# Altium schematic sheet led-monitoring-0402-SN74HC365PW.SchDoc: SN74HC365PW LED Monitoring
size A4; DrawnBy: Dylan Vogel; Organization: UTAT SS; Revision: 1.1
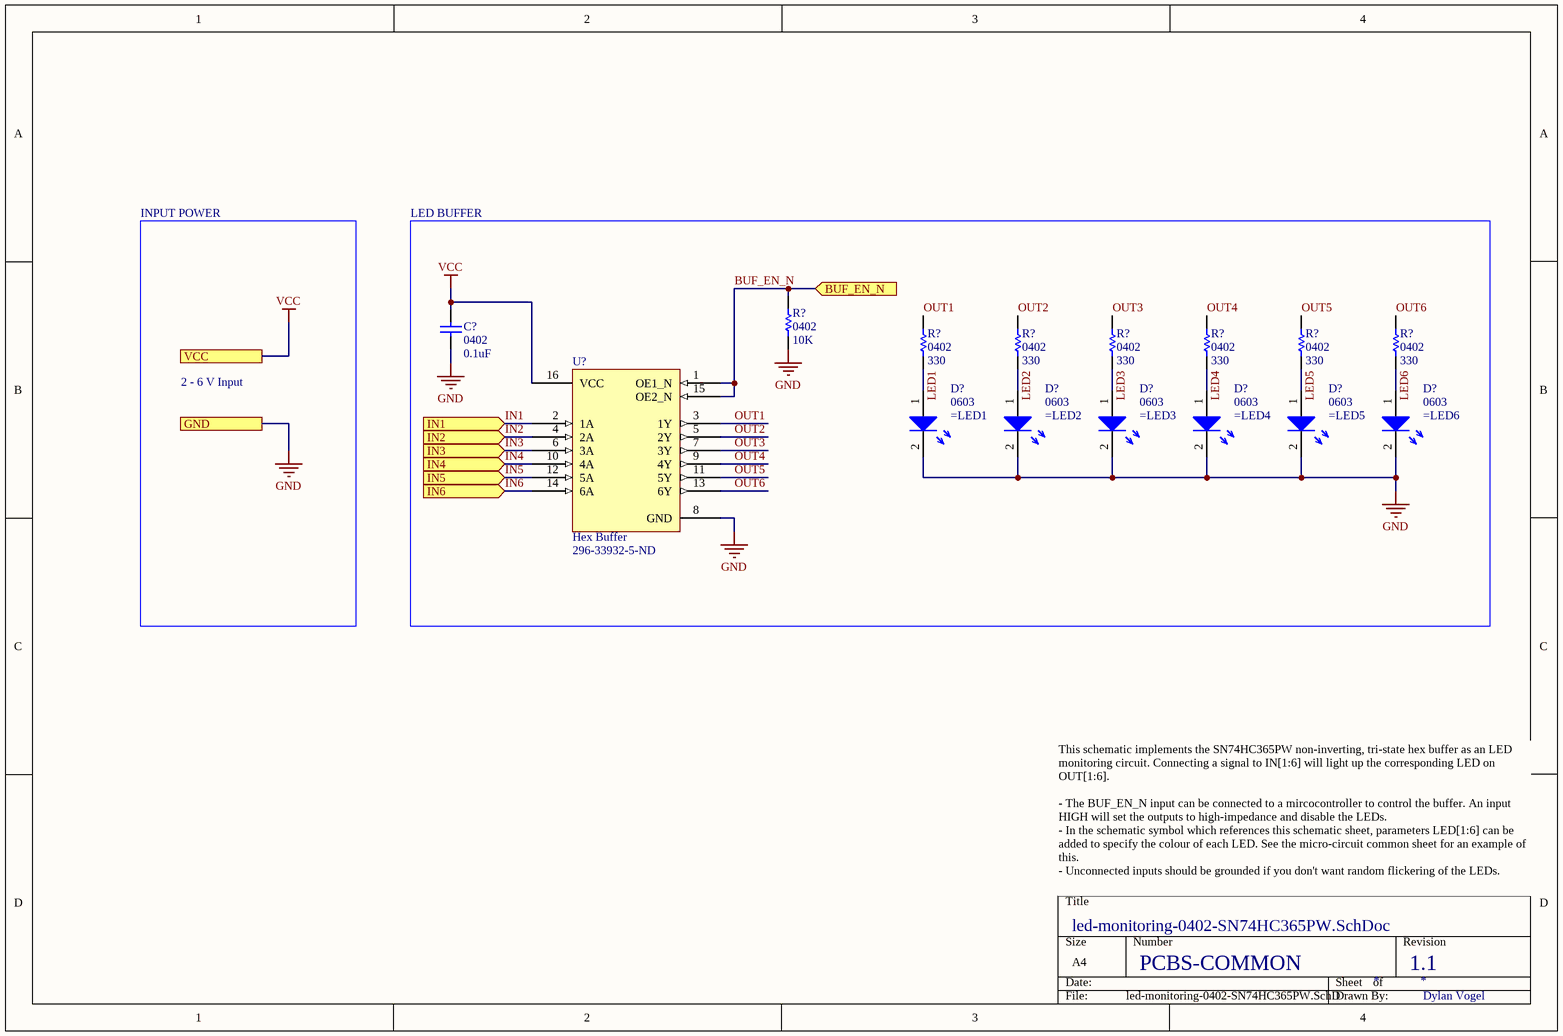
[diagram p0: led-monitoring-0402-SN74HC365PW.SchDoc]

## Parts
(Parts that share a designator on the sheet are numbered #1, #2 ... from top to bottom, then left to right.)
C?  0402  value 0.1uF  [CAP0402R]
D?#1  0603  [LED0603]
D?#2  0603  [LED0603]
D?#3  0603  [LED0603]
D?#4  0603  [LED0603]
D?#5  0603  [LED0603]
D?#6  0603  [LED0603]
R?#1  0402  value 10K  [RES0402R]
R?#2  0402  value 330  [RES0402R]
R?#3  0402  value 330  [RES0402R]
R?#4  0402  value 330  [RES0402R]
R?#5  0402  value 330  [RES0402R]
R?#6  0402  value 330  [RES0402R]
R?#7  0402  value 330  [RES0402R]
U?  Hex Buffer  Supplier Part Number 1: 296-33932-5-ND  [SOP65P640X120-16N]

## Blocks framed on the sheet
LED BUFFER: C? D?#1-D?#6 R?#1-R?#7 U?

## Ports
BUF_EN_N (in), GND, IN1 (in), IN2 (in), IN3 (in), IN4 (in), IN5 (in), IN6 (in), VCC

## Nets
GND: C?.1 D?#1.2 D?#2.2 D?#3.2 D?#4.2 D?#5.2 D?#6.2 R?#1.1 U?.8(GND) ; port GND
VCC: C?.2 U?.16(VCC) ; port VCC
BUF_EN_N: R?#1.2 U?.1(OE1_N) U?.15(OE2_N) ; port BUF_EN_N
IN1: U?.2(1A) ; port IN1
IN2: U?.4(2A) ; port IN2
IN3: U?.6(3A) ; port IN3
IN4: U?.10(4A) ; port IN4
IN5: U?.12(5A) ; port IN5
IN6: U?.14(6A) ; port IN6
LED1: D?#1.1 R?#2.1
LED2: D?#2.1 R?#3.1
LED3: D?#3.1 R?#4.1
LED4: D?#4.1 R?#5.1
LED5: D?#5.1 R?#6.1
LED6: D?#6.1 R?#7.1
OUT1: R?#2.2 U?.3(1Y)
OUT2: R?#3.2 U?.5(2Y)
OUT3: R?#4.2 U?.7(3Y)
OUT4: R?#5.2 U?.9(4Y)
OUT5: R?#6.2 U?.11(5Y)
OUT6: R?#7.2 U?.13(6Y)

## Notes on the sheet
- INPUT POWER
- 2 - 6 V Input
- This schematic implements the SN74HC365PW non-inverting, tri-state hex buffer as an LED monitoring circuit. Connecting a signal to IN[1:6] will light up the corresponding LED on OUT[1:6].
  - The BUF_EN_N input can be connected to a mircocontroller to control the buffer. An input HIGH will set the outputs to high-impedance and disable the LEDs.
  - In the schematic symbol which references this schematic sheet, parameters LED[1:6] can be added to specify the colour of each LED. See the micro-circuit common sheet for an example of this.
  - Unconnected inputs should be grounded if you don't want random flickering of the LEDs.
- PCBS-COMMON

## Library data of the parts
C? = Cap: Capacitor; Published: 8-Jun-2000; LatestRevisionDate: 17-Jul-2002; LatestRevisionNote: Re-released for DXP Platform.; PackageReference: RAD-0.3; Publisher: Altium Limited; PackageDescription: Radial Cap, Thru-Hole; 2 Leads; 0.3 in Pin Spacing
D?#1-D?#6 = LED: Just a generic LED
  D?#1: Value: =LED1
  D?#2: Value: =LED2
  D?#3: Value: =LED3
  D?#4: Value: =LED4
  D?#5: Value: =LED5
  D?#6: Value: =LED6
R?#1-R?#7 = Res1: Resistor; Published: 8-Jun-2000; LatestRevisionDate: 17-Jul-2002; LatestRevisionNote: Re-released for DXP Platform.; PackageReference: AXIAL-0.3; Publisher: Altium Limited; PackageDescription: Axial Device, Thru-Hole; 2 Leads; 0.3 in Pin Spacing
U? = SN74HC365PW: Hex non-inverting buffer with 3-state outputs; Supplier 1: Digi-Key